# EAGLE design netnode (EAGLE 4.11)
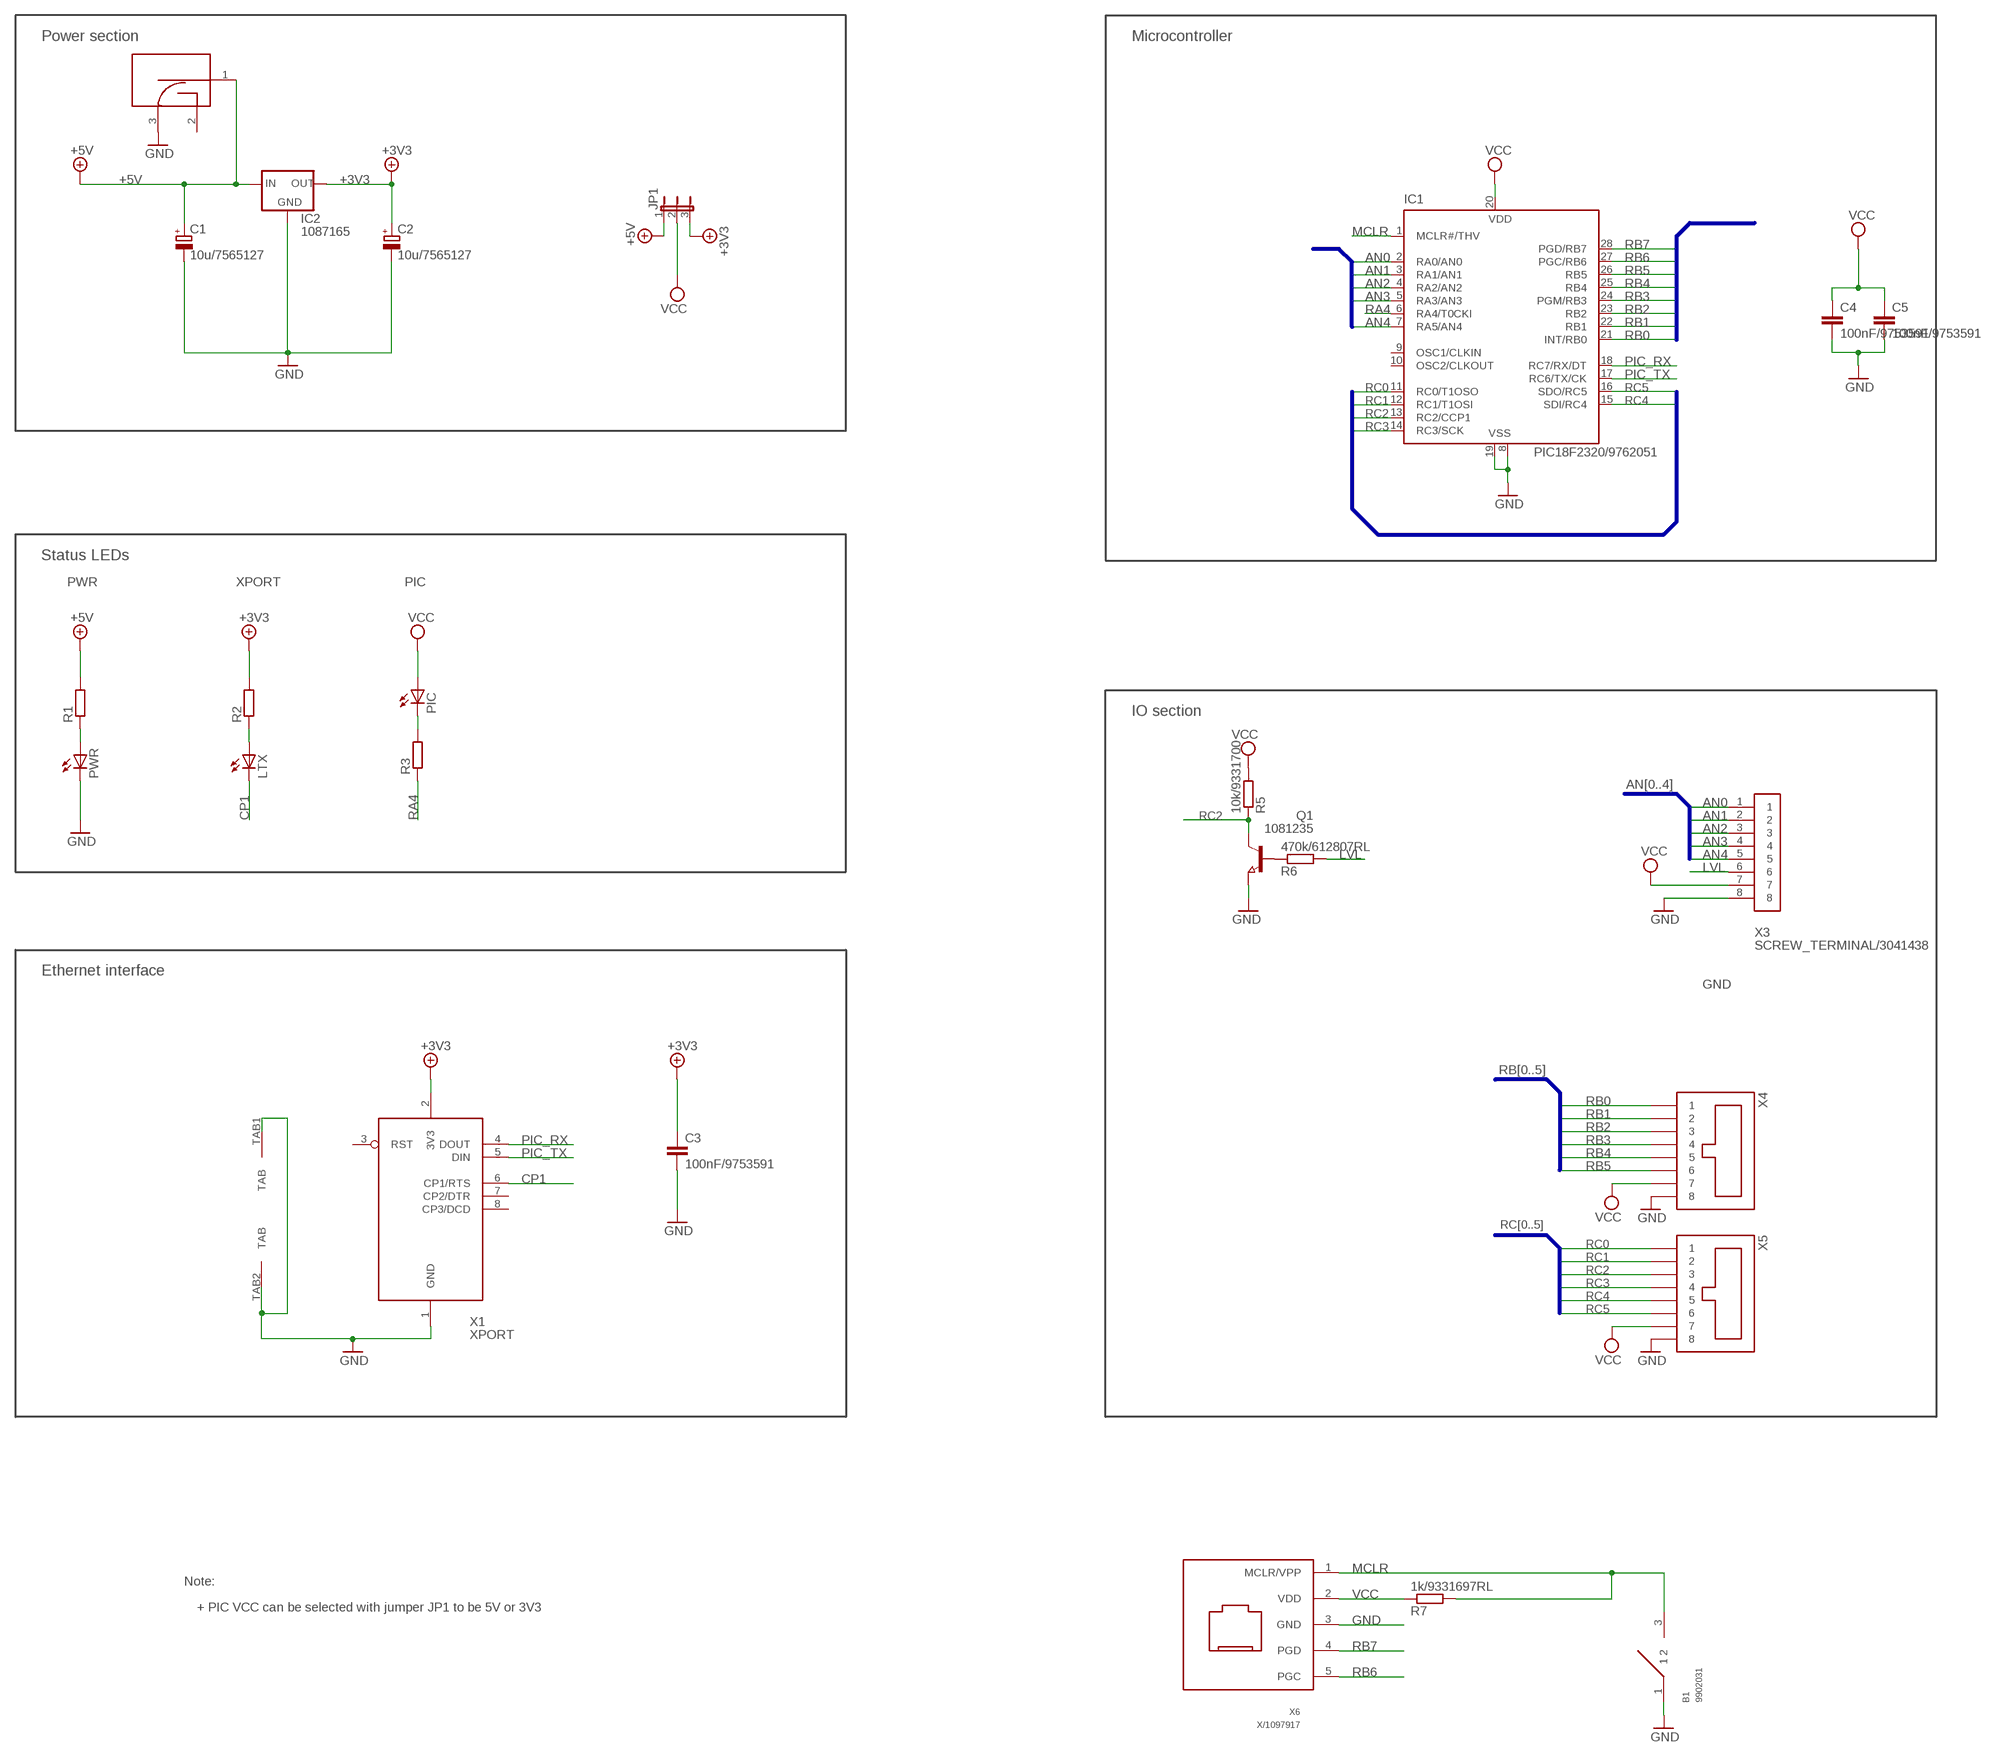
[diagram p0: schematic, sheet 1]

## Parts
B1  9902031  PUSHBUTTON  [PUSHBUTTON]
C1  10u/7565127  CHIPCAP  [CHIPCAP]
C2  10u/7565127  CHIPCAP  [CHIPCAP]
C3  100nF/9753591  C-EUC0805  [C0805]
C4  100nF/9753591  C-EUC0805  [C0805]
C5  100nF/9753591  C-EUC0805  [C0805]
IC1  PIC18F2320/9762051  PIC16F876SO  [SO-28W]
IC2  1087165  78XXSLD  [78XXS]
JP1  JP2E  [JP2]
LTX  LEDCHIPLED_1206  [CHIPLED_1206]
PIC  LEDCHIPLED_1206  [CHIPLED_1206]
PWR  LEDCHIPLED_1206  [CHIPLED_1206]
Q1  1081235  NPN-TRANSISTOR_SOT23  [SOT23]
R1  R-EU_R0603  [R0603]
R2  R-EU_R0603  [R0603]
R3  R-EU_R0603  [R0603]
R5  10k/9331700  R-EU_R0603  [R0603]
R6  470k/612807RL  R-EU_R0603  [R0603]
R7  1k/9331697RL  R-EU_R0603  [R0603]
X1  XPORT  [XPORT]
X2  DC10R/224959  DC10R  [DC10R]
X3  SCREW_TERMINAL/3041438  SCREW_TERMINAL  [SCREW_TERMINAL_8PINS]
X4  RJ45H  [RJ45H]
X5  RJ45H  [RJ45H]
X6  X/1097917  ICD_CONNV  [RJ11]

## Nets
+3V3: C2.+ C3.1 IC2.GND(OUT) JP1.3 R2.2 X1.2(3V3)
+5V: C1.+ IC2.OUT(IN) JP1.1 R1.2 X2.1(CENTER)
AN0: IC1.2(RA0/AN0) X3.1
AN1: IC1.3(RA1/AN1) X3.2
AN2: IC1.4(RA2/AN2) X3.3
AN3: IC1.5(RA3/AN3) X3.4
AN4: IC1.7(RA5/AN4) X3.5
CP1: LTX.C X1.6(CP1/RTS)
GND: B1.1 C1.- C2.- C3.2 C4.2 C5.2 IC1.8(VSS) IC1.19(VSS) IC2.IN(GND) PWR.C Q1.2(E) X1.1(GND) X1.TAB1(TAB) X1.TAB2(TAB) X2.3(SHIELD) X3.8 X4.P$8 X5.P$8 X6.3(GND)
LVL: R6.2 X3.6
MCLR: B1.3 IC1.1(MCLR#/THV) R7.2 X6.1(MCLR/VPP)
N$1: Q1.1(B) R6.1
N$2: PWR.A R1.1
N$7: LTX.A R2.1
PIC: PIC.C R3.2
PIC_RX: IC1.18(RC7/RX/DT) X1.4(DOUT)
PIC_TX: IC1.17(RC6/TX/CK) X1.5(DIN)
RA4: IC1.6(RA4/T0CKI) R3.1
RB0: IC1.21(INT/RB0) X4.P$1
RB1: IC1.22(RB1) X4.P$2
RB2: IC1.23(RB2) X4.P$3
RB3: IC1.24(PGM/RB3) X4.P$4
RB4: IC1.25(RB4) X4.P$5
RB5: IC1.26(RB5) X4.P$6
RB6: IC1.27(PGC/RB6) X6.5(PGC)
RB7: IC1.28(PGD/RB7) X6.4(PGD)
RC0: IC1.11(RC0/T1OSO) X5.P$1
RC1: IC1.12(RC1/T1OSI) X5.P$2
RC2: IC1.13(RC2/CCP1) Q1.3(C) R5.1 X5.P$3
RC3: IC1.14(RC3/SCK) X5.P$4
RC4: IC1.15(SDI/RC4) X5.P$5
RC5: IC1.16(SDO/RC5) X5.P$6
VCC: C4.1 C5.1 IC1.20(VDD) JP1.2 PIC.A R5.2 R7.1 X3.7 X4.P$7 X5.P$7 X6.2(VDD)
Unconnected: IC1.9(OSC1/CLKIN) IC1.10(OSC2/CLKOUT) X1.3(RST) X1.7(CP2/DTR) X1.8(CP3/DCD) X2.2(CONTACT) X6.6(NC)

## Buses
AN[0..4]
RB[0..5]
RB[0..7]
RC[0..5]

## Notes on the sheet
- Power section | Microcontroller
- Status LEDs
- PWR | XPORT | PIC
- IO section
- Ethernet interface
- Note:
- + PIC VCC can be selected with jumper JP1 to be 5V or 3V3

## Library data of the parts
B1 = netnode:PUSHBUTTON: PUSH BUTTON nice stylish microbutton Farnell: 9902031
C1 C2 = netnode:CHIPCAP
C3-C5 = netnode:C-EU: CAPACITOR, European symbol
IC1 = netnode:PIC16*876: MICROCONTROLLER flash type
IC2 = netnode:78XXS: VOLTAGE REGULATOR
JP1 = netnode:JP2E: JUMPER
LTX PIC PWR = led:LED: LED OSRAM: - CHIPLED LG R971, LG N971, LY N971, LG Q971, LY Q971, LO R971, LY R971 LH N974, LH R974 LS Q976, LO Q976, LY Q976 LO Q996 - Hyper CHIPLED LW Q18S LB Q993, LB Q99A, LB R99A - SideLED LS A670, LO A670, LY A670, LG A670, LP A670 LB A673, LV A673, LT A673, LW A673 LH A674 LY A675 LS A676, LA A676, LO A676, LY A676, LW A676 LS A679, LY A679, LG A679 - Hyper Micro SIDELED® LS Y876, LA Y876, LO Y876, LY Y876 LT Y87S - SmartLED LW L88C, LW L88S LB L89C, LB L89S, LG L890 LS L89K, LO L89K, LY L89K LS L896, LA L896, LO L896, LY L896 - TOPLED LS T670, LO T670, LY T670, LG T670, LP T670 LSG T670, LSP T670, LSY T670, LOP T670, LYG T670 LG T671, LOG T671, LSG T671 LB T673, LV T673, LT T673, LW T673 LH T674 LS T676, LA T676, LO T676, LY T676, LB T676, LH T676, LSB T676, LW T676 LB T67C, LV T67C, LT T67C, LS T67K, LO T67K, LY T67K, LW E67C LS E67B, LA E67B, LO E67B, LY E67B, LB E67C, LV E67C, LT E67C LW T67C LS T679, LY T679, LG T679 LS T770, LO T770, LY T770, LG T770, LP T770 LB T773, LV T773, LT T773, LW T773 LH T774 LS E675, LA E675, LY E675, LS T675 LS T776, LA T776, LO T776, LY T776, LB T776 LHGB T686 LT T68C, LB T68C - Hyper Mini TOPLED® LB M676 - Mini TOPLED Santana® LG M470 LS M47K, LO M47K, LY M47K Source: http://www.osram.convergy.de/
Q1 = semicon-smd-ipc:NPN-TRANSISTOR_: NPN TRANSISTOR
R1-R3 R5-R7 = netnode:R-EU_: RESISTOR, European symbol
X1 = netnode:XPORT
X2 = netnode:DC10*: DC power plug 2.1 mm center plug Farnell order nr: 224959
X3 = netnode:SCREW_TERMINAL: SCREW TERMINAL Farnell: 3041438
X4 X5 = netnode:RJ45*
X6 = netnode:ICD_CONN: Microchip ICD2 connector Farnell: 1097917

## Board
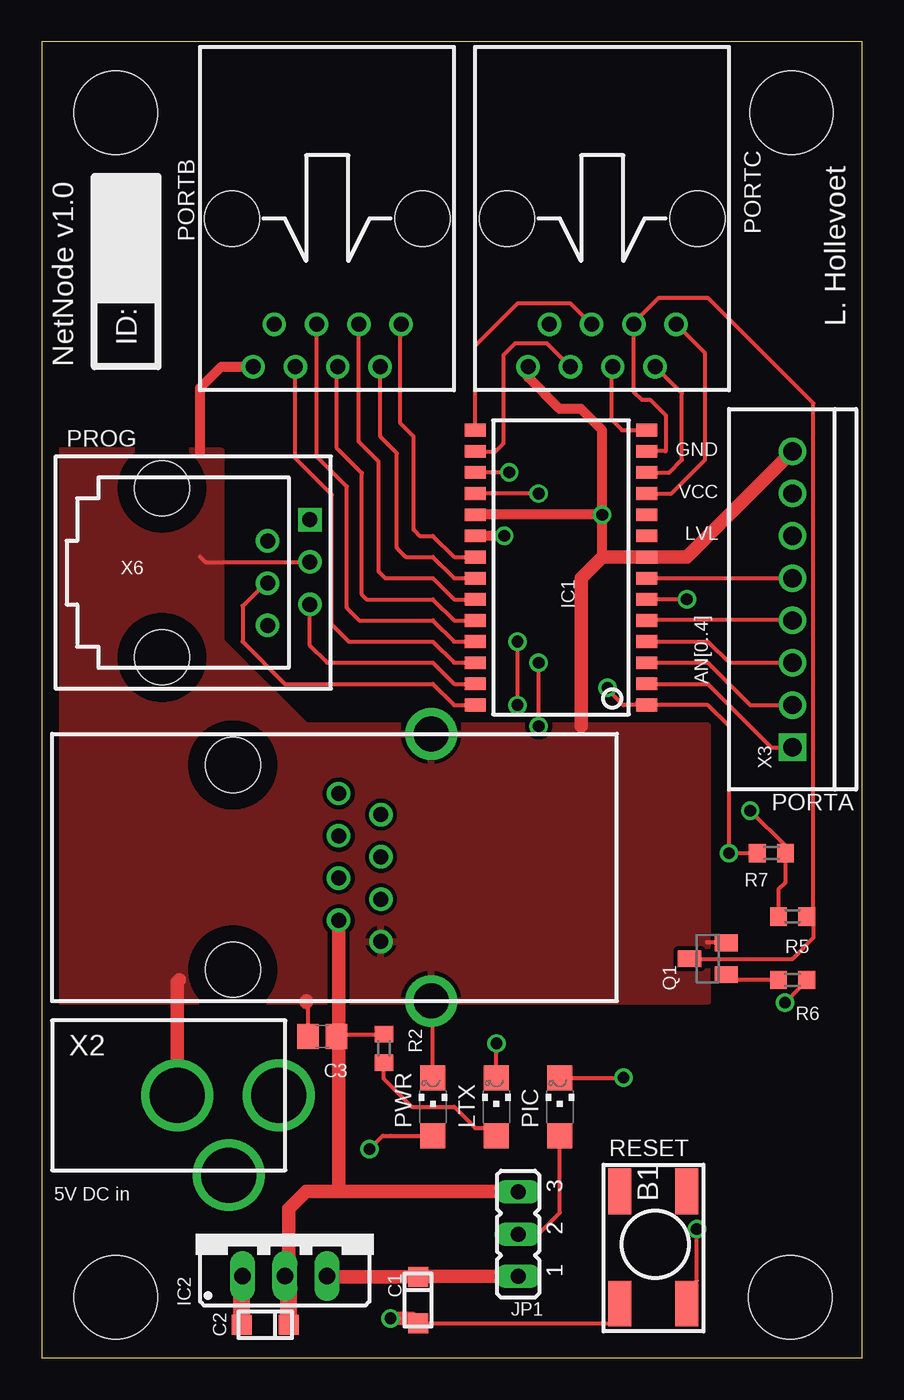
[diagram p1: board, top side]
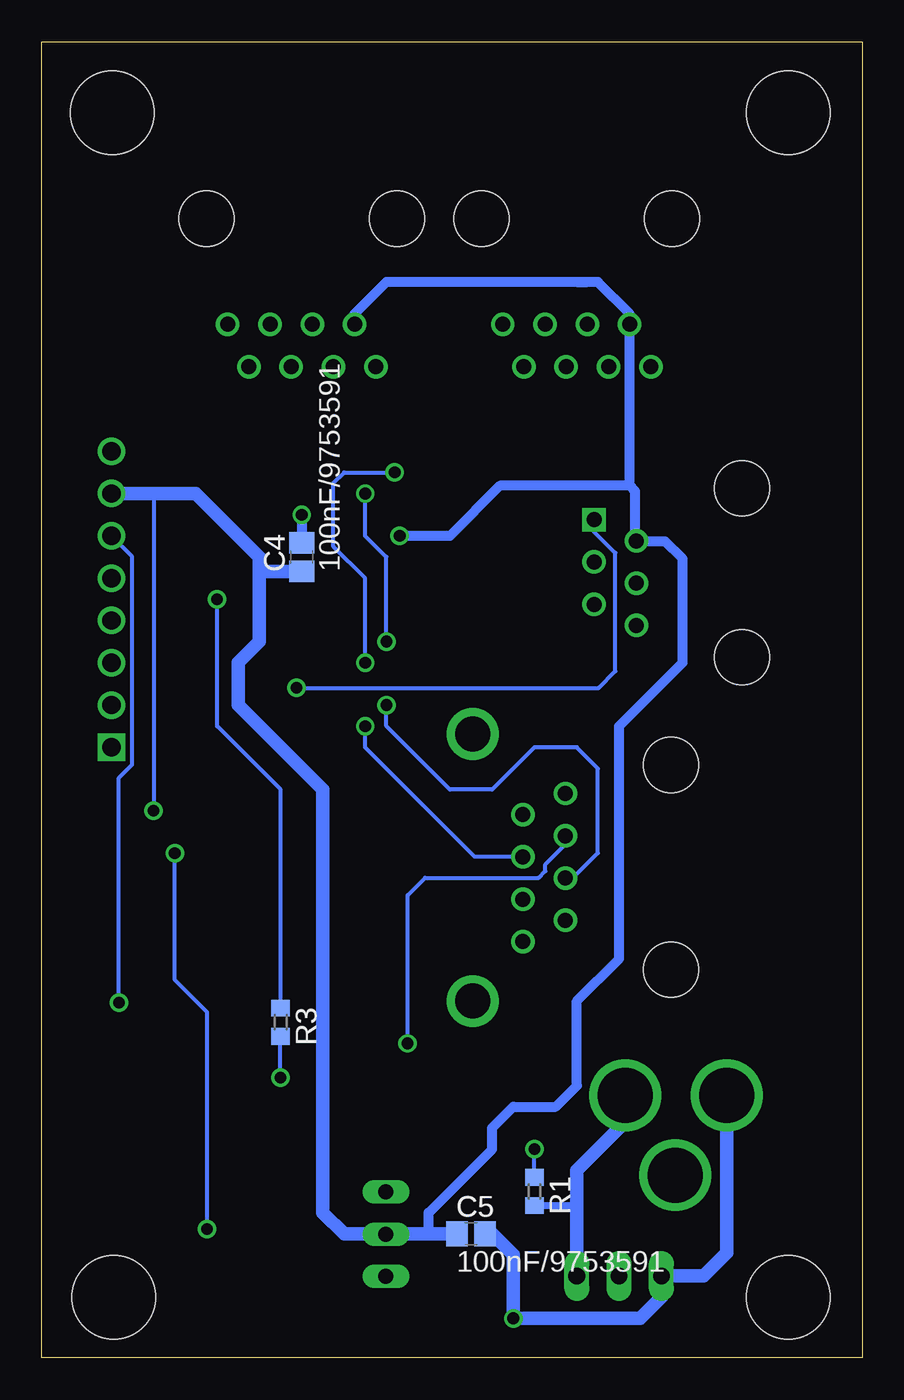
[diagram p2: board, bottom side, seen from below]

Size 49.27 x 79.04 mm. Coordinates in mm from the lower left corner, seen from the top.
Outline: 0,0 49.27,0 49.27,79.04 0,79.04 0,0
Copper layers (1*16): Top 0.035mm / dielectric 1.5mm / Bottom 0.035mm
Design rules "10mils": minimum track width 10mil, minimum drill 24mil, track to track 10mil, track to pad 10mil, pad to pad 10mil, via to via 10mil, smd to smd 10mil, copper to edge 40mil, drill to drill 10mil, minimum pad ring 10mil, minimum via ring 8mil, stop-mask expansion 0mil, vias tented up to drill 0mil, thermal gap 10mil
Holes 5 mm at 44.95,3.65 4.44,3.65 4.44,74.77 45.02,74.77

### Footprints (pad centres in the part's own frame; a part is rotated, then mirrored left to right if it is on the bottom)
PUSHBUTTON = smd 2.75 x 1.4: 1 6.73,-4.03; 2 0,-4.03; 3 6.73,0; 4 0,0
CHIPCAP = smd 1.2 x 1.2: + 0.2,0.8; - 3,0.8
C0805 = smd 1.3 x 1.5: 1 -0.85,0; 2 0.85,0
SO-28W = smd 0.762 x 1.27: 1 -7.62,-5.207; 2 -6.35,-5.207; 3 -5.08,-5.207; 4 -3.81,-5.207; 5 -2.54,-5.207; 6 -1.27,-5.207; 7 0,-5.207; 8 1.27,-5.207; 9 2.54,-5.207; 10 3.81,-5.207; 11 5.08,-5.207; 12 6.35,-5.207; 13 7.62,-5.207; 14 8.89,-5.207; 15 8.89,5.08; 16 7.62,5.08; 17 6.35,5.08; 18 5.08,5.08; 19 3.81,5.08; 20 2.54,5.08; 21 1.27,5.08; 22 0,5.08; 23 -1.27,5.08; 24 -2.54,5.08; 25 -3.81,5.08; 26 -5.08,5.08; 27 -6.35,5.08; 28 -7.62,5.08
78XXS = drill 1 long: GND 0,-2.54; IN -2.54,-2.54; OUT 2.54,-2.54
JP2 = drill 0.9 long: 1 -2.54,0; 2 0,0; 3 2.54,0
CHIPLED_1206 = smd 1.5 x 1.5: A 0,-1.75; C 0,1.75
SOT23 = smd 1 x 1.4: 1 -0.95,-1.1; 2 0.95,-1.1; 3 0,1.1
R0603 = smd 1 x 1.1: 1 -0.85,0; 2 0.85,0
XPORT = drill 0.9 round: 1 19.74,3.58; 2 17.2,4.85; 3 19.74,6.12; 4 17.2,7.39; 5 19.74,8.66; 6 17.2,9.93; 7 19.74,11.2; 8 17.2,12.47 | drill 2.1 round: TAB1 22.75,0; TAB2 22.75,16.05 | hole 3.3: 10.85,1.88; 10.85,14.18
DC10R = drill 3.3 round: 1 13.6,4.5; 2 10.6,-0.29; 3 7.5,4.5
SCREW_TERMINAL_8PINS = drill 1.1 square: 1 0,0 | drill 1.1 round: 2 2.54,0; 3 5.08,0; 4 7.62,0; 5 10.16,0; 6 12.7,0; 7 15.24,0; 8 17.78,0
RJ45H = drill 0.9 round: P$1 -4.445,6.35; P$2 -3.175,8.89; P$3 -1.905,6.35; P$4 -0.635,8.89; P$5 0.635,6.35; P$6 1.905,8.89; P$7 3.175,6.35; P$8 4.445,8.89 | hole 3.3: -5.715,0; 5.715,0
RJ11 = drill 0.9 square: 1 0,11.43 | drill 0.9 round: 2 1.27,8.89; 3 2.54,11.43; 4 3.81,8.89; 5 5.08,11.43; 6 6.35,8.89 | hole 3.3: 8.27,2.56; -1.89,2.56

### Placement (x,y rotation side)
B1  38.73,10 270 top
C1  21.79,5.07 270 top
C2  15.02,2.79 180 top
C3  16.85,19.32 180 top
C4  33.65,48.09 90 bottom
C5  23.49,7.46 0 bottom
IC1  31.11,46.83 90 top
IC2  14.6,7.46 0 top
JP1  28.6,7.42 90 top
LTX  27.3,15.08 0 top
PIC  31.11,15.08 0 top
PWR  23.49,15.08 0 top
Q1  40,23.96 90 top
R1  19.68,10 270 bottom
R2  20.55,18.59 90 top
R3  34.92,20.16 270 bottom
R5  45.08,26.51 180 top
R6  45.08,22.7 0 top
R7  43.81,30.32 180 top
X1  0.63,21.43 0 top
X2  0.63,11.27 0 top
X3  45.08,36.66 90 top
X4  17.14,68.41 180 top
X5  33.65,68.41 180 top
X6  4.67,50.34 270 top

### Tracks (layer width: path | path; a pad name or v marks a point on that pad's centre or on a via)
+3V3
  Top 0.254: 15.87,10 17.79,10 17.83,10.04 | 17.83,15.04 17.73,15.04 17.83,15.14 17.7,15.27 C3.1 17.81,19.32 17.83,19.34 17.93,19.44 R2.2
  Top 0.813: 14.82,4.7 14.82,8.95 15.87,10 28.57,10 JP1.3 | 17.83,26.34 X1.2 17.83,19.34 17.83,15.14 17.83,15.04 17.83,10.04
  Top 1.016: C2.+ 14.82,4.7 IC2.GND
+5V
  Top 0.813: IC2.OUT 17.18,4.87 C1.+ 22.56,4.87 | 22.56,4.87 22.53,4.83 | JP1.1 C1.+ 22.56,4.87
  Bottom 0.406: R1.2 17.56,9.15 17.14,8.73
  Bottom 0.813: X2.1 14.23,14.18 17.14,11.27 17.14,8.73 IC2.OUT
AN0
  Top 0.254: IC1.2 40,40.48 43.81,36.66 X3.1
AN1
  Top 0.254: IC1.3 40,41.74 42.54,39.2 X3.2
AN2
  Top 0.254: IC1.4 40,43.02 41.27,41.74 X3.3
AN3
  Top 0.254: IC1.5 36.93,44.34 45.03,44.34 X3.4
AN4
  Top 0.254: IC1.7 36.93,46.84 44.33,46.84 X3.5
CP1  (via drill 0.7)
  Top 0.254: LTX.C 27.3,16.8 | 27.3,16.8 v27.3,18.89 | 27.3,16.8 27.23,16.73
  Bottom 0.254: X1.6 17.83,30.84 19.03,29.64 19.03,29.23 19.43,28.84 26.24,28.84 27.3,27.78 v27.3,18.89
GND  (via drill 0.7)
  Top 0.254: Q1.2 40.43,24.94 40.13,24.94 39.94,24.96 | 22.22,2.38 22.52,2.07 C1.- 34.27,2.07 34.73,2.54 34.73,3.13 34.83,3.23 34.8,3.27 B1.1 | X1.TAB1 23.49,21.43 PWR.C | X6.3 9.82,47.8 9.52,48.09 | 15.87,21.34 15.83,21.34 16,21.16 C3.2
  Top 0.61: X4.P$8 10.79,59.52 9.52,58.26 9.52,54.45 | X5.P$8 29.2,58.89 31.11,56.98 32.38,56.98 33.65,55.72 v33.65,50.63 | 33.65,48.09 v33.65,50.63 | v33.65,50.63 IC1.19
  Top 0.813: 15.87,21.34 15.87,21.43 | 32.38,37.94 32.38,46.83 33.65,48.09 IC1.8 38.73,48.09 X3.8 | v20.95,2.38 22.22,2.38 | X2.3 8.13,22.57 8.25,22.7
  Top 1.016: C2.- 12.02,4.88 IC2.IN
  Top 1.27: 20.43,25.04 20.4,25.01 X1.1
  Bottom 0.61: v33.65,50.63 C4.2
  Bottom 0.813: C5.2 22.22,7.46 20.95,6.18 v20.95,2.38 13.33,2.38 12.06,3.65 IC2.IN 9.52,4.92 8.13,6.3 X2.3
  pour Top: 0.63,21.43 40,21.43 40,37.94 15.87,37.94 10.79,43.02 10.79,54.45 0.63,54.45
LVL  (via drill 0.7)
  Top 0.254: v44.63,21.34 45.53,22.23 R6.2
  Bottom 0.254: v44.63,21.34 44.63,34.84 43.83,35.63 43.83,48.12 X3.6
MCLR  (via drill 0.7)
  Top 0.254: v39.33,7.74 39.33,4.63 B1.3 | IC1.1 35.73,39.34 | R7.2 42.93,30.34 42.91,30.32 v41.27,30.32 41.27,37.94 40,39.2 IC1.1 | v33.96,40.23 33.89,40.23 34.92,39.2 IC1.1
  Bottom 0.254: v39.33,7.74 39.33,20.76 41.27,22.7 v41.27,30.32 | X6.1 16.1,49.61 14.83,48.34 14.83,41.23 15.83,40.23 v33.96,40.23
N$1
  Top 0.254: R6.1 43.83,22.73 41.73,22.73 Q1.1
N$2  (via drill 0.7)
  Top 0.254: PWR.A 20.94,13.34 20.48,13.34 v19.68,12.54
  Bottom 0.254: R1.1 v19.68,12.54
N$7
  Top 0.254: R2.1 20.55,16.75 22.22,15.08 24.76,15.08 26.03,13.81 26.76,13.81 27.24,13.33 LTX.A
PIC  (via drill 0.7)
  Top 0.254: PIC.C v34.92,16.82 v34.93,16.84
  Bottom 0.254: R3.2 34.92,19.32 34.93,19.34 v34.93,16.84
PIC_RX  (via drill 0.7)
  Top 0.254: v28.57,39.2 v28.57,43.02 | v29.84,51.91 IC1.18
  Bottom 0.254: X1.4 17.37,28.82 15.87,30.32 15.87,35.4 17.14,36.66 19.68,36.66 22.22,34.12 24.76,34.12 28.57,37.94 v28.57,39.2 | v28.57,43.02 28.57,48.09 29.84,49.37 v29.84,51.91
PIC_TX  (via drill 0.7)
  Top 0.254: v28.07,53.18 IC1.17 | v29.84,37.94 v29.84,41.74
  Bottom 0.254: X1.5 23.26,30.09 29.84,36.66 v29.84,37.94 | v29.84,41.74 29.84,46.83 31.74,48.73 31.74,52.54 31.11,53.18 v28.07,53.18 27.93,53.18
RA4  (via drill 0.7)
  Top 0.254: 36.19,45.55 IC1.6 v38.73,45.55
  Bottom 0.254: R3.1 34.92,34.12 38.73,37.94 v38.73,45.55
RB0
  Top 0.254: IC1.21 24.76,48.09 23.49,49.37 22.7,49.37 22.33,49.73 22.33,55.34 21.53,56.13 21.53,62.13 21.58,62.08 X4.P$1
RB1
  Top 0.254: IC1.22 24.76,46.83 23.49,48.09 21.87,48.09 21.33,48.63 21.33,54.34 20.33,55.34 X4.P$2
RB2
  Top 0.254: IC1.23 24.76,45.55 23.49,46.83 20.64,46.83 20.23,47.23 20.23,53.84 19.03,55.04 19.03,62.13 19.04,62.12 X4.P$3
RB3
  Top 0.254: IC1.24 24.76,44.29 23.49,45.55 19.51,45.55 19.23,45.84 19.23,53.13 17.73,54.63 17.73,59.44 17.77,59.48 X4.P$4
RB4
  Top 0.254: IC1.25 24.76,43.02 23.49,44.29 19.08,44.29 18.33,45.04 18.33,52.34 16.53,54.13 16.53,62.04 X4.P$5
RB5
  Top 0.254: IC1.26 24.76,41.74 23.49,43.02 18.45,43.02 17.43,44.04 17.43,51.84 15.23,54.04 15.23,59.44 15.24,59.44 X4.P$6
RB6
  Top 0.254: X6.5 16.1,42.79 17.14,41.74 23.49,41.74 24.76,40.48 IC1.27
RB7
  Top 0.254: IC1.28 24.76,39.2 23.49,40.48 14.6,40.48 12.06,43.02 12.06,45.16 13.53,46.63 13.56,46.61 X6.4
RC0
  Top 0.254: IC1.11 37.8,51.91 39.83,53.94 39.83,60.34 X5.P$1
RC1
  Top 0.254: IC1.12 37.67,53.18 38.43,53.94 38.43,57.94 X5.P$2
RC2
  Top 0.254: Q1.3 45.08,23.96 46.35,25.23 46.35,26.51 R5.1 45.86,26.51 45.83,26.54 46.33,27.04 46.33,57.34 40.03,63.63 37.03,63.63 35.53,62.13 35.55,62.11 X5.P$3 35.55,61.96 35.53,61.94 35.53,58.04 36.03,57.54 36.53,57.54 37.46,56.61 37.46,54.45 IC1.13
RC3
  Top 0.254: IC1.14 34.85,55.72 34.23,56.34 34.23,59.54 34.24,59.52 X5.P$4
RC4
  Top 0.254: IC1.15 26.03,60.8 28.57,63.34 31.73,63.34 33.02,62.05 | 33.02,62.05 33.03,62.04 | 33.02,62.05 X5.P$5
RC5
  Top 0.254: IC1.16 26.52,54.45 26.53,54.44 27.23,54.44 27.73,54.94 27.73,60.23 28.43,60.94 30.33,60.94 X5.P$6
VCC  (via drill 0.7)
  Top 0.254: PIC.A 31.11,8.73 29.84,7.46 28.57,7.46 JP1.2 | R5.2 44.23,28.14 44.63,28.54 44.63,30.23 44.66,30.27 R7.1 44.66,30.73 v42.54,32.86
  Top 0.61: v27.77,49.37 IC1.20
  Bottom 0.254: 42.54,51.91 v42.54,32.86
  Bottom 0.406: 36.19,47.23 36.23,47.23 36.22,47.24
  Bottom 0.61: 13.97,52.37 X4.P$7 | 13.97,52.37 13.63,52.04 13.63,49.13 | X6.2 13.6,49.06 13.63,49.04 13.63,49.13 | X5.P$7 30.47,62.7 28.57,64.6 17.14,64.6 | X4.P$7 13.93,62.04 | 17.14,64.6 16.5,64.6 | X4.P$7 13.96,62.7 15.87,64.6 17.14,64.6 | 13.97,52.37 21.75,52.37 24.76,49.37 v27.77,49.37 | 26.03,7.46 26.03,8.73 22.22,12.54 22.22,13.81 20.95,15.08 18.41,15.08 17.14,16.35 17.14,21.43 14.6,23.96 14.6,37.94 10.79,41.74 10.79,47.99 11.83,49.04 13.53,49.04 13.63,49.13
  Bottom 0.813: 28.57,7.46 JP1.2 | C5.1 26.03,7.46 28.57,7.46 | 28.57,7.46 31.11,7.46 32.38,8.73 32.38,34.12 37.46,39.2 37.46,41.74 36.19,43.02 36.19,47.23 | 36.19,47.23 36.19,48.09 40,51.91 42.54,51.91 X3.7 | C4.1 33.63,47.23 36.19,47.23

### Text on the board
Top: Mirror check
Bottom: Mirror check
tPlace: Mirror check | PORTC | PORTB | L. Hollevoet | ID: | NetNode v1.0 | PROG | GND | VCC | LVL | AN[0..4] | PORTA | RESET | 5V DC in
tNames: 3 | 2 | 1
bNames: 100nF/9753591 | C4 | R3 | R1 | C5 | 100nF/9753591
tStop: Mirror check
bStop: Mirror check